# Altium schematic sheet LED_SW_BUT.SchDoc: LED-Switch
size A4; Date: 2016-06-28; Author: Vitali Tsiukala; DrawnBy: Vitali Tsiukala; Engineer: Vitali Tsiukala; Organization: Trenz Electronic GmbH; DocumentNumber: TE0706; Revision: 02; SheetNumber: 6; SheetTotal: 10
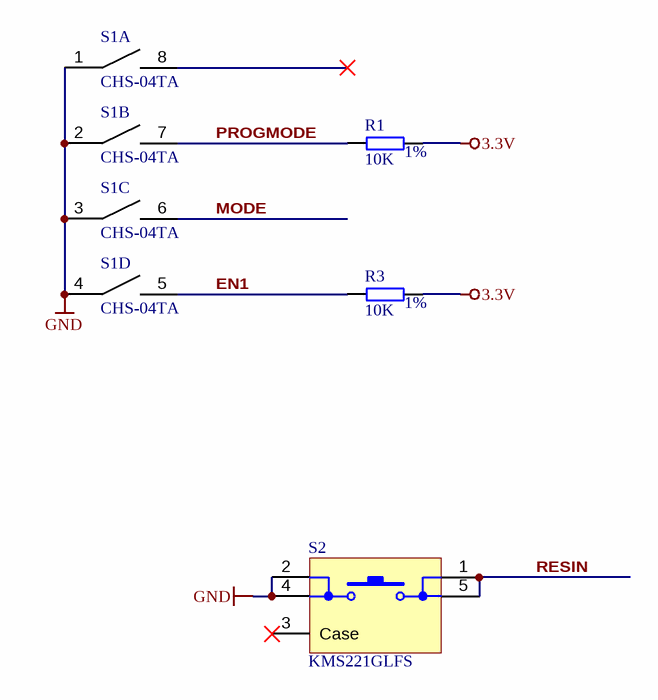
[diagram p0: LED_SW_BUT.SchDoc]

## Parts
R1  10K  Tolerance: 1%  [RESC1005X40N]
R3  10K  Tolerance: 1%  [RESC1005X40N]
S1  CHS-04TA  [CHS-04TA]  (parts A,B,C,D of 4)
S2  KMS221GLFS  [KMS2xxGLFS]

## Nets
3.3V: R1.1 R3.1
GND: S1.1 S1.2 S1.3 S1.4 S2.2 S2.4
EN1: R3.2 S1.5
MODE: S1.6
PROGMODE: R1.2 S1.7
RESIN: S2.1 S2.5

Not connected (* = marked no-connect by the designer): S1 8*; S2 3(Case)*

## Notes on the sheet
- Title:
- Number:
- Rev.
- Date:
- A4
- Copyright:
- Page
- of
- Filename:

## Library data of the parts
R1 R3 = 22750: WID SMD 10K 1% 0,063W; AN: 22750; Mixed: SMT; Preferred: Yes; Case: 1005 (0402); Value: 10K; Technology: TK100
S1 = 23417: DIP Schalter 4 fach 1,27mm SMD; AN: 23417; Trenz-Stock: Yes; Mixed: SMT; HelpURL: B:\AD\adlib\datasheet\CHS; Preferred: Yes; H-ART: CHS-04TA
S2 = 26229: KMS221GLFS - SWITCH, SPST, 0.05A, 32VDC, SMD; AN: 26229; Mixed: SMT; HelpURL: B:\AD\adlib\datasheet\KMS; H-ART: KMS221GLFS